# EAGLE design ATmega328P-StripBd (EAGLE 9.2.2)
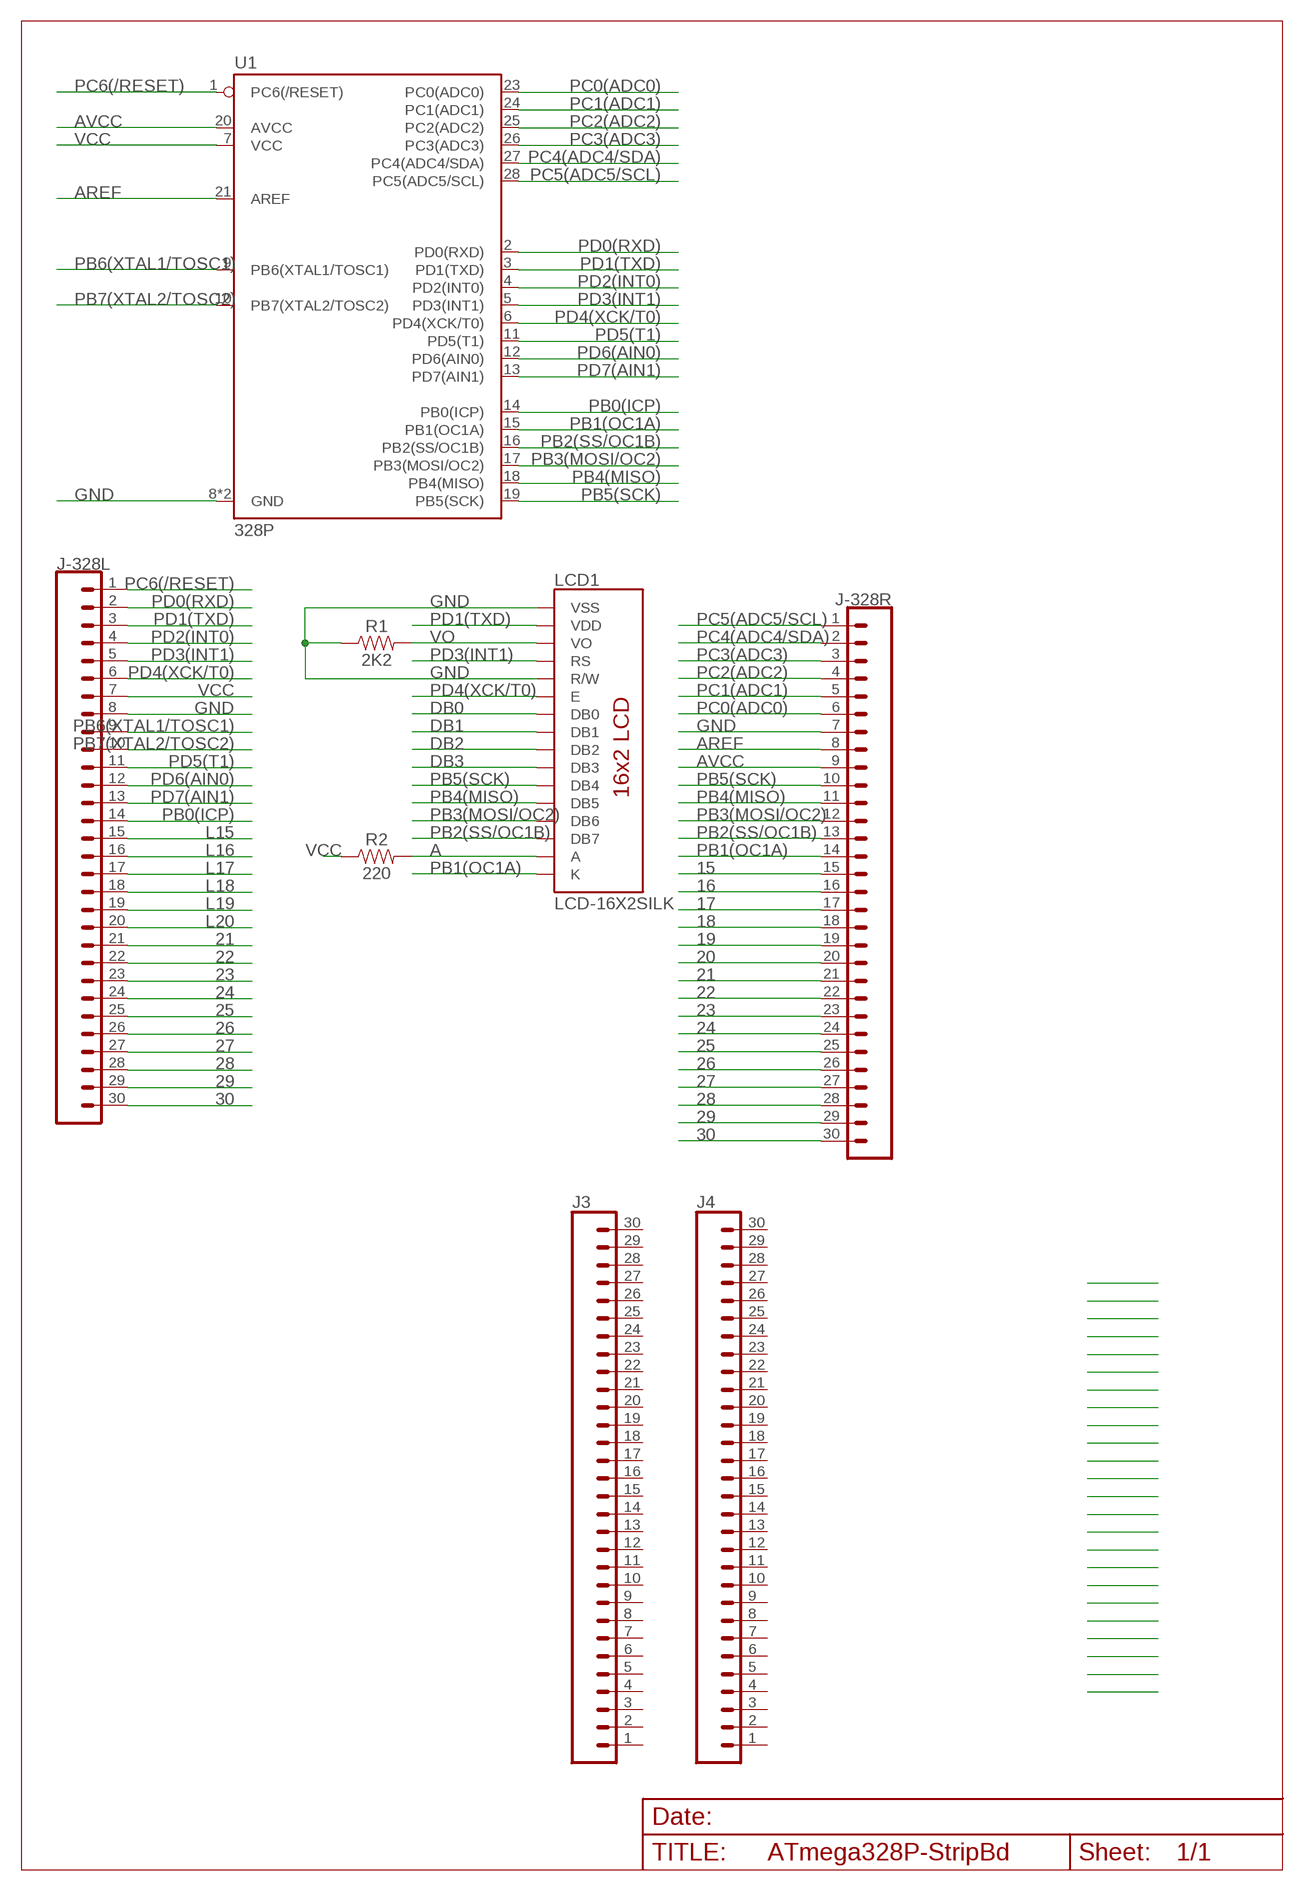
[diagram p0: schematic, sheet 1]

## Parts
J3  CONN_30  [1X30]
J4  CONN_30  [1X30]
J-328L  CONN_30  [1X30]
J-328R  CONN_30  [1X30]
LCD1  LCD-16X2SILK  [LCD-16X2]
R1  2K2  1KOHM-HORIZ-1/4W-5%  [AXIAL-0.3]
R2  220  1KOHM-HORIZ-1/4W-5%  [AXIAL-0.3]
U1  328P  ATMEGA328P_PDIP  [DIP28]

## Nets
15: J-328R.15
16: J-328R.16
17: J-328R.17
18: J-328R.18
19: J-328R.19
20: J-328R.20
21: J-328L.21 J-328R.21
22: J-328L.22 J-328R.22
23: J-328L.23 J-328R.23
24: J-328L.24 J-328R.24
25: J-328L.25 J-328R.25
26: J-328L.26 J-328R.26
27: J-328L.27 J-328R.27
28: J-328L.28 J-328R.28
29: J-328L.29 J-328R.29
30: J-328L.30 J-328R.30
A: LCD1.15(A) R2.P$2
AREF: J-328R.8 U1.21(AREF)
AVCC: J-328R.9 U1.20(AVCC)
DB0: LCD1.7(DB0)
DB1: LCD1.8(DB1)
DB2: LCD1.9(DB2)
DB3: LCD1.10(DB3)
GND: J-328L.8 J-328R.7 LCD1.1(VSS) LCD1.5(R/W) R1.P$1 U1.8(GND) U1.22(GND)
L15: J-328L.15
L16: J-328L.16
L17: J-328L.17
L18: J-328L.18
L19: J-328L.19
L20: J-328L.20
PB0(ICP): J-328L.14 U1.14(PB0(ICP))
PB1(OC1A): J-328R.14 LCD1.16(K) U1.15(PB1(OC1A))
PB2(SS/OC1B): J-328R.13 LCD1.14(DB7) U1.16(PB2(SS/OC1B))
PB3(MOSI/OC2): J-328R.12 LCD1.13(DB6) U1.17(PB3(MOSI/OC2))
PB4(MISO): J-328R.11 LCD1.12(DB5) U1.18(PB4(MISO))
PB5(SCK): J-328R.10 LCD1.11(DB4) U1.19(PB5(SCK))
PB6(XTAL1/TOSC1): J-328L.9 U1.9(PB6(XTAL1/TOSC1))
PB7(XTAL2/TOSC2): J-328L.10 U1.10(PB7(XTAL2/TOSC2))
PC0(ADC0): J-328R.6 U1.23(PC0(ADC0))
PC1(ADC1): J-328R.5 U1.24(PC1(ADC1))
PC2(ADC2): J-328R.4 U1.25(PC2(ADC2))
PC3(ADC3): J-328R.3 U1.26(PC3(ADC3))
PC4(ADC4/SDA): J-328R.2 U1.27(PC4(ADC4/SDA))
PC5(ADC5/SCL): J-328R.1 U1.28(PC5(ADC5/SCL))
PC6(/RESET): J-328L.1 U1.1(PC6(/RESET))
PD0(RXD): J-328L.2 U1.2(PD0(RXD))
PD1(TXD): J-328L.3 LCD1.2(VDD) U1.3(PD1(TXD))
PD2(INT0): J-328L.4 U1.4(PD2(INT0))
PD3(INT1): J-328L.5 LCD1.4(RS) U1.5(PD3(INT1))
PD4(XCK/T0): J-328L.6 LCD1.6(E) U1.6(PD4(XCK/T0))
PD5(T1): J-328L.11 U1.11(PD5(T1))
PD6(AIN0): J-328L.12 U1.12(PD6(AIN0))
PD7(AIN1): J-328L.13 U1.13(PD7(AIN1))
VCC: J-328L.7 R2.P$1 U1.7(VCC)
VO: LCD1.3(VO) R1.P$2
Unconnected: J3.1 J3.2 J3.3 J3.4 J3.5 J3.6 J3.7 J3.8 J3.9 J3.10 J3.11 J3.12 J3.13 J3.14 J3.15 J3.16 J3.17 J3.18 J3.19 J3.20 J3.21 J3.22 J3.23 J3.24 J3.25 J3.26 J3.27 J3.28 J3.29 J3.30 J4.1 J4.2 J4.3 J4.4 J4.5 J4.6 J4.7 J4.8 J4.9 J4.10 J4.11 J4.12 J4.13 J4.14 J4.15 J4.16 J4.17 J4.18 J4.19 J4.20 J4.21 J4.22 J4.23 J4.24 J4.25 J4.26 J4.27 J4.28 J4.29 J4.30

## Library data of the parts
J3 J4 J-328L J-328R = SparkFun-Connectors:CONN_30: Multi connection point. Often used as Generic Header-pin footprint for 0.1 inch spaced/style header connections On any of the 0.1 inch spaced packages, you can populate with these: Break Away Headers - Straight <https://www.sparkfun.com/products/116> (PRT-00116) Break Away Male Headers - Right Angle <https://www.sparkfun.com/products/553> (PRT-00553) Female Headers <https://www.sparkfun.com/products/115> (PRT-00115) Break Away Headers - Machine Pin <https://www.sparkfun.com/products/117> (PRT-00117) Break Away Female Headers - Swiss Machine Pin <https://www.sparkfun.com/products/743> (PRT-00743) For SCREWTERMINALS and SPRING TERMINALS visit here: Screw Terimnals on SparkFun.com <https://www.sparkfun.com/search/results?term=Screw+Terminals> (5mm/3.5mm/2.54mm spacing) This device is also useful as a general connection point to wire up your design to another part of your project. Our various solder wires solder well into these plated through hole pads. Hook-Up Wire - Assortment (Stranded, 22 AWG) <https://www.sparkfun.com/products/11375> (PRT-11375) Hook-Up Wire - Assortment (Solid Core, 22 AWG) <https://www.sparkfun.com/products/11367> (PRT-11367) View the entire wire category on our website here <https://www.sparkfun.com/categories/141> Special notes: Molex polarized connector foot print use with SKU : PRT-08231 with associated crimp pins and housings. 1MM SMD Version SKU: PRT-10208 NOTES ON THE VARIANTS LOCK and LOCK_LONGPADS... This footprint was designed to help hold the alignment of a through-hole component (i.e. 6-pin header) while soldering it into place. You may notice that each hole has been shifted either up or down by 0.005 of an inch from it's more standard position (which is a perfectly straight line). This slight alteration caused the pins (the squares in the middle) to touch the edges of the holes. Because they are alternating, it causes a "brace" to hold the component in place. 0.005 has proven to be the perfect amount of "off-center" position when using our standard breakaway headers. Although looks a little odd when you look at the bare footprint, once you have a header in there, the alteration is very hard to notice. Also,if you push a header all the way into place, it is covered up entirely on the bottom side.
LCD1 = SparkFun-Displays:LCD-16X2: Standard text-only 16x2 parallel input LCD Basic 16 character by 2 line display. Typically utilizes the extremely common HD44780 parallel interface chipset SparkFun Products: Basic 16x2 Green <https://www.sparkfun.com/products/255> Basic 8x2 Green <https://www.sparkfun.com/products/11122>; SF_ID: LCD-00255
R1 R2 = SparkFun-Resistors:1KOHM: 1kΩ resistor A resistor is a passive two-terminal electrical component that implements electrical resistance as a circuit element. Resistors act to reduce current flow, and, at the same time, act to lower voltage levels within circuits. - Wikipedia; PROD_ID: RES-08380; VALUE: 1k
U1 = SparkFun-IC-Microcontroller:ATMEGA328P_PDIP: Atmel 328P Through hole ATMEGA328P uC used in the Arduino 32kb flash, 1k EEPROM, 2k SRAM Datasheet <http://www.sparkfun.com/datasheets/Components/SMD/ATMega328.pdf> SparkFun Products Storefront component: AVR 28 Pin 20MHz 32K 6A/D - ATMega328P <https://www.sparkfun.com/products/9061> (COM-09061) SparkFun Simon Says - Through-Hole Soldering Kit <https://www.sparkfun.com/products/10547> (KIT-10547) SparkFun Learn to Solder - Simon Says <https://www.sparkfun.com/products/13708> (KIT-13708) SparkFun BigTime Watch Kit <https://www.sparkfun.com/products/11734> (KIT-11734) SparkFun ClockIt <https://www.sparkfun.com/products/10930> (KIT-10930) SparkFun Serial Enabled LCD Kit <https://www.sparkfun.com/products/10097> (LCD-10097) SparkFun Simon Tilts - Through Hole Soldering Kit <https://www.sparkfun.com/products/12634> (KIT-12634) SparkFun Frequency Counter Kit <https://www.sparkfun.com/products/10140> (KIT-10140) FabFM Radio Kit <https://www.sparkfun.com/products/11043> (KIT-11043) SparkFun Binary Blaster Kit <https://www.sparkfun.com/products/12037> (KIT-12037) SparkFun Metro-Gnome <https://www.sparkfun.com/products/9236> (KIT-09236) ATmega328 with Arduino Optiboot (Uno) <https://www.sparkfun.com/products/10524> (DEV-10524); PROD_ID: IC-09136

## Board
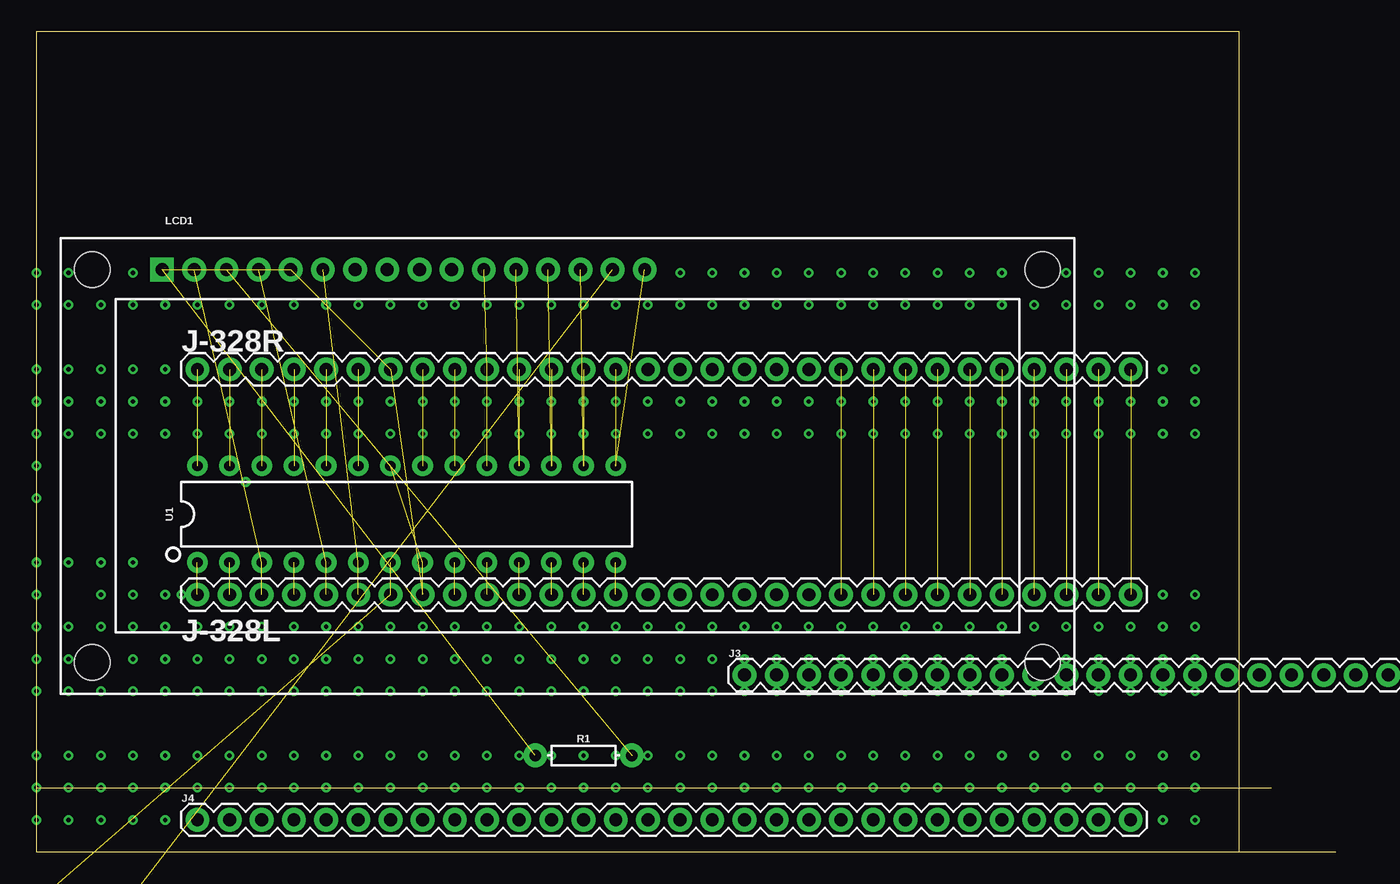
[diagram p1: board, top side]

Size 102.54 x 64.76 mm. Coordinates in mm from the lower left corner, seen from the top.
Outline: 94.92,0 94.92,64.76 0,64.76 0,0 94.92,0
Outline: 94.92,0 102.54,0
Outline: 0,5.08 97.46,5.08
Copper layers (1*16): Top 0.035mm / dielectric 1.5mm / Bottom 0.035mm
Design rules "default": minimum track width 6mil, minimum drill 0.35mm, track to track 6mil, track to pad 6mil, pad to pad 6mil, via to via 6mil, smd to smd 6mil, copper to edge 40mil, drill to drill 6mil, minimum pad ring 10mil, minimum via ring 8mil, stop-mask expansion 4mil, vias tented up to drill 0mil, thermal gap 10mil

### Footprints (pad centres in the part's own frame; a part is rotated, then mirrored left to right if it is on the bottom)
1X30 = drill 1.016 pad 1.88: 1 0,0; 2 2.54,0; 3 5.08,0; 4 7.62,0; 5 10.16,0; 6 12.7,0; 7 15.24,0; 8 17.78,0; 9 20.32,0; 10 22.86,0; 11 25.4,0; 12 27.94,0; 13 30.48,0; 14 33.02,0; 15 35.56,0; 16 38.1,0; 17 40.64,0; 18 43.18,0; 19 45.72,0; 20 48.26,0; 21 50.8,0; 22 53.34,0; 23 55.88,0; 24 58.42,0; 25 60.96,0; 26 63.5,0; 27 66.04,0; 28 68.58,0; 29 71.12,0; 30 73.66,0
LCD-16X2 = drill 1.016 pad 1.88 square: 1 -32,15.5 | drill 1.016 pad 1.88: 2 -29.46,15.5; 3 -26.92,15.5; 4 -24.38,15.5; 5 -21.84,15.5; 6 -19.3,15.5; 7 -16.76,15.5; 8 -14.22,15.5; 9 -11.68,15.5; 10 -9.14,15.5; 11 -6.6,15.5; 12 -4.06,15.5; 13 -1.52,15.5; 14 1.02,15.5; 15 3.56,15.5; 16 6.1,15.5 | hole 2.8: -37.5,15.5; -37.5,-15.5; 37.5,15.5; 37.5,-15.5
AXIAL-0.3 = drill 0.9 pad 1.88: P$1 -3.81,0; P$2 3.81,0
DIP28 = drill 0.813 pad 1.626: 1 -16.51,-3.81; 2 -13.97,-3.81; 3 -11.43,-3.81; 4 -8.89,-3.81; 5 -6.35,-3.81; 6 -3.81,-3.81; 7 -1.27,-3.81; 8 1.27,-3.81; 9 3.81,-3.81; 10 6.35,-3.81; 11 8.89,-3.81; 12 11.43,-3.81; 13 13.97,-3.81; 14 16.51,-3.81; 15 16.51,3.81; 16 13.97,3.81; 17 11.43,3.81; 18 8.89,3.81; 19 6.35,3.81; 20 3.81,3.81; 21 1.27,3.81; 22 -1.27,3.81; 23 -3.81,3.81; 24 -6.35,3.81; 25 -8.89,3.81; 26 -11.43,3.81; 27 -13.97,3.81; 28 -16.51,3.81

### Placement (x,y rotation side)
J3  55.88,13.97 0 top
J4  12.7,2.54 0 top
J-328L  12.7,20.32 0 top
J-328R  12.7,38.1 0 top
LCD1  41.91,30.48 0 top
R1  43.18,7.62 0 top
R2  2.54,-5.08 0 top  (outside the outline)
U1  29.21,26.67 0 top

### Tracks (layer width: path | path; a pad name or v marks a point on that pad's centre or on a via)
21  (1 unrouted)
22  (1 unrouted)
23  (1 unrouted)
24  (1 unrouted)
25  (1 unrouted)
26  (1 unrouted)
27  (1 unrouted)
28  (1 unrouted)
29  (1 unrouted)
30  (1 unrouted)
A  (1 unrouted)
AREF  (1 unrouted)
AVCC  (1 unrouted)
GND  (6 unrouted)
N$9  (via drill 0.35)
  other vias: 0,5.08
N$10  (via drill 0.35)
  other vias: 0,2.54
N$11  (via drill 0.35)
  other vias: 0,30.48
N$12  (via drill 0.35)
  other vias: 0,33.02
N$13  (via drill 0.35)
  other vias: 0,12.7 0,27.94
N$14  (via drill 0.35)
  other vias: 0,15.24
N$15  (via drill 0.35)
  other vias: 0,17.78
N$16  (via drill 0.35)
  other vias: 0,20.32
N$17  (via drill 0.35)
  other vias: 0,22.86
N$18  (via drill 0.35)
  other vias: 0,35.56
N$19  (via drill 0.35)
  other vias: 0,38.1
N$20  (via drill 0.35)
  other vias: 0,43.18
N$21  (via drill 0.35)
  other vias: 0,45.72
N$22  (via drill 0.35)
  other vias: 0,7.62
N$23  (via drill 0.35)
  other vias: 2.54,15.24
N$24  (via drill 0.35)
  other vias: 2.54,17.78
N$25  (via drill 0.35)
  other vias: 11.43,20.32
N$26  (via drill 0.35)
  other vias: 2.54,22.86
N$27  (via drill 0.35)
  other vias: 5.08,15.24
N$28  (via drill 0.35)
  other vias: 5.08,17.78
N$29  (via drill 0.35)
  other vias: 5.08,20.32
N$30  (via drill 0.35)
  other vias: 5.08,22.86
N$31  (via drill 0.35)
  other vias: 7.62,15.24
N$32  (via drill 0.35)
  other vias: 7.62,17.78
N$33  (via drill 0.35)
  other vias: 7.62,20.32
N$34  (via drill 0.35)
  other vias: 7.62,22.86
N$35  (via drill 0.35)
  other vias: 2.54,12.7
N$36  (via drill 0.35)
  other vias: 5.08,12.7
N$37  (via drill 0.35)
  other vias: 7.62,12.7
N$38  (via drill 0.35)
  other vias: 10.16,15.24
N$39  (via drill 0.35)
  other vias: 10.16,17.78
N$40  (via drill 0.35)
  other vias: 10.16,20.32
N$41  (via drill 0.35)
  other vias: 12.7,15.24
N$42  (via drill 0.35)
  other vias: 12.7,17.78
N$43  (via drill 0.35)
  other vias: 12.7,20.32
N$44  (via drill 0.35)
  other vias: 15.24,15.24
N$45  (via drill 0.35)
  other vias: 15.24,17.78
N$46  (via drill 0.35)
  other vias: 15.24,20.32
N$47  (via drill 0.35)
  other vias: 10.16,12.7
N$48  (via drill 0.35)
  other vias: 12.7,12.7
N$49  (via drill 0.35)
  other vias: 15.24,12.7
N$50  (via drill 0.35)
  other vias: 17.78,15.24
N$51  (via drill 0.35)
  other vias: 17.78,17.78
N$52  (via drill 0.35)
  other vias: 17.78,20.32
N$53  (via drill 0.35)
  other vias: 20.32,15.24
N$54  (via drill 0.35)
  other vias: 20.32,17.78
N$55  (via drill 0.35)
  other vias: 20.32,20.32
N$56  (via drill 0.35)
  other vias: 22.86,15.24
N$57  (via drill 0.35)
  other vias: 22.86,17.78
N$58  (via drill 0.35)
  other vias: 22.86,20.32
N$59  (via drill 0.35)
  other vias: 17.78,12.7
N$60  (via drill 0.35)
  other vias: 20.32,12.7
N$61  (via drill 0.35)
  other vias: 22.86,12.7
N$62  (via drill 0.35)
  other vias: 25.4,15.24
N$63  (via drill 0.35)
  other vias: 25.4,17.78
N$64  (via drill 0.35)
  other vias: 25.4,20.32
N$65  (via drill 0.35)
  other vias: 27.94,15.24
N$66  (via drill 0.35)
  other vias: 27.94,17.78
N$67  (via drill 0.35)
  other vias: 27.94,20.32
N$68  (via drill 0.35)
  other vias: 30.48,15.24
N$69  (via drill 0.35)
  other vias: 30.48,17.78
N$70  (via drill 0.35)
  other vias: 30.48,20.32
N$71  (via drill 0.35)
  other vias: 25.4,12.7
N$72  (via drill 0.35)
  other vias: 27.94,12.7
N$73  (via drill 0.35)
  other vias: 30.48,12.7
N$74  (via drill 0.35)
  other vias: 33.02,15.24
N$75  (via drill 0.35)
  other vias: 33.02,17.78
N$76  (via drill 0.35)
  other vias: 33.02,20.32
N$77  (via drill 0.35)
  other vias: 35.56,15.24
N$78  (via drill 0.35)
  other vias: 35.56,17.78
N$79  (via drill 0.35)
  other vias: 35.56,20.32
N$80  (via drill 0.35)
  other vias: 38.1,15.24
N$81  (via drill 0.35)
  other vias: 38.1,17.78
N$82  (via drill 0.35)
  other vias: 38.1,20.32
N$83  (via drill 0.35)
  other vias: 33.02,12.7
N$84  (via drill 0.35)
  other vias: 35.56,12.7
N$85  (via drill 0.35)
  other vias: 38.1,12.7
N$86  (via drill 0.35)
  other vias: 40.64,15.24
N$87  (via drill 0.35)
  other vias: 40.64,17.78
N$88  (via drill 0.35)
  other vias: 40.64,20.32
N$89  (via drill 0.35)
  other vias: 43.18,15.24
N$90  (via drill 0.35)
  other vias: 43.18,17.78
N$91  (via drill 0.35)
  other vias: 43.18,20.32
N$92  (via drill 0.35)
  other vias: 45.72,15.24
N$93  (via drill 0.35)
  other vias: 45.72,17.78
N$94  (via drill 0.35)
  other vias: 45.72,20.32
N$95  (via drill 0.35)
  other vias: 40.64,12.7
N$96  (via drill 0.35)
  other vias: 43.18,12.7
N$97  (via drill 0.35)
  other vias: 45.72,12.7
N$98  (via drill 0.35)
  other vias: 48.26,15.24
N$99  (via drill 0.35)
  other vias: 48.26,17.78
N$100  (via drill 0.35)
  other vias: 48.26,20.32
N$101  (via drill 0.35)
  other vias: 50.8,15.24
N$102  (via drill 0.35)
  other vias: 50.8,17.78
N$103  (via drill 0.35)
  other vias: 50.8,20.32
N$104  (via drill 0.35)
  other vias: 53.34,15.24
N$105  (via drill 0.35)
  other vias: 53.34,17.78
N$106  (via drill 0.35)
  other vias: 53.34,20.32
N$107  (via drill 0.35)
  other vias: 48.26,12.7
N$108  (via drill 0.35)
  other vias: 50.8,12.7
N$109  (via drill 0.35)
  other vias: 53.34,12.7
N$110  (via drill 0.35)
  other vias: 55.88,15.24
N$111  (via drill 0.35)
  other vias: 55.88,17.78
N$112  (via drill 0.35)
  other vias: 55.88,20.32
N$113  (via drill 0.35)
  other vias: 58.42,15.24
N$114  (via drill 0.35)
  other vias: 58.42,17.78
N$115  (via drill 0.35)
  other vias: 58.42,20.32
N$116  (via drill 0.35)
  other vias: 60.96,15.24
N$117  (via drill 0.35)
  other vias: 60.96,17.78
N$118  (via drill 0.35)
  other vias: 60.96,20.32
N$119  (via drill 0.35)
  other vias: 55.88,12.7
N$120  (via drill 0.35)
  other vias: 58.42,12.7
N$121  (via drill 0.35)
  other vias: 60.96,12.7
N$122  (via drill 0.35)
  other vias: 63.5,15.24
N$123  (via drill 0.35)
  other vias: 63.5,17.78
N$124  (via drill 0.35)
  other vias: 63.5,20.32
N$125  (via drill 0.35)
  other vias: 66.04,15.24
N$126  (via drill 0.35)
  other vias: 66.04,17.78
N$127  (via drill 0.35)
  other vias: 66.04,20.32
N$128  (via drill 0.35)
  other vias: 68.58,15.24
N$129  (via drill 0.35)
  other vias: 68.58,17.78
N$130  (via drill 0.35)
  other vias: 68.58,20.32
N$131  (via drill 0.35)
  other vias: 63.5,12.7
N$132  (via drill 0.35)
  other vias: 66.04,12.7
N$133  (via drill 0.35)
  other vias: 68.58,12.7
N$134  (via drill 0.35)
  other vias: 71.12,15.24
N$135  (via drill 0.35)
  other vias: 71.12,17.78
N$136  (via drill 0.35)
  other vias: 71.12,20.32
N$137  (via drill 0.35)
  other vias: 73.66,15.24
N$138  (via drill 0.35)
  other vias: 73.66,17.78
N$139  (via drill 0.35)
  other vias: 73.66,20.32
N$140  (via drill 0.35)
  other vias: 76.2,15.24
N$141  (via drill 0.35)
  other vias: 76.2,17.78
N$142  (via drill 0.35)
  other vias: 76.2,20.32
N$143  (via drill 0.35)
  other vias: 71.12,12.7
N$144  (via drill 0.35)
  other vias: 73.66,12.7
N$145  (via drill 0.35)
  other vias: 76.2,12.7
N$146  (via drill 0.35)
  other vias: 78.74,15.24
N$147  (via drill 0.35)
  other vias: 78.74,17.78
N$148  (via drill 0.35)
  other vias: 78.74,20.32
N$149  (via drill 0.35)
  other vias: 81.28,15.24
N$150  (via drill 0.35)
  other vias: 81.28,17.78
N$151  (via drill 0.35)
  other vias: 81.28,20.32
N$152  (via drill 0.35)
  other vias: 83.82,15.24
N$153  (via drill 0.35)
  other vias: 83.82,17.78
N$154  (via drill 0.35)
  other vias: 83.82,20.32
N$155  (via drill 0.35)
  other vias: 78.74,12.7
N$156  (via drill 0.35)
  other vias: 81.28,12.7
N$157  (via drill 0.35)
  other vias: 83.82,12.7
N$158  (via drill 0.35)
  other vias: 86.36,15.24
N$159  (via drill 0.35)
  other vias: 86.36,17.78
N$160  (via drill 0.35)
  other vias: 86.36,20.32
N$161  (via drill 0.35)
  other vias: 88.9,15.24
N$162  (via drill 0.35)
  other vias: 88.9,17.78
N$163  (via drill 0.35)
  other vias: 88.9,20.32
N$164  (via drill 0.35)
  other vias: 91.44,15.24
N$165  (via drill 0.35)
  other vias: 91.44,17.78
N$166  (via drill 0.35)
  other vias: 91.44,20.32
N$167  (via drill 0.35)
  other vias: 86.36,12.7
N$168  (via drill 0.35)
  other vias: 88.9,12.7
N$169  (via drill 0.35)
  other vias: 91.44,12.7
N$170  (via drill 0.35)
  other vias: 2.54,33.02
N$171  (via drill 0.35)
  other vias: 2.54,35.56
N$172  (via drill 0.35)
  other vias: 2.54,38.1
N$173  (via drill 0.35)
  other vias: 5.08,33.02
N$174  (via drill 0.35)
  other vias: 5.08,35.56
N$175  (via drill 0.35)
  other vias: 5.08,38.1
N$176  (via drill 0.35)
  other vias: 7.62,33.02
N$177  (via drill 0.35)
  other vias: 7.62,35.56
N$178  (via drill 0.35)
  other vias: 7.62,38.1
N$179  (via drill 0.35)
  other vias: 10.16,33.02
N$180  (via drill 0.35)
  other vias: 10.16,35.56
N$181  (via drill 0.35)
  other vias: 10.16,38.1
N$182  (via drill 0.35)
  other vias: 12.7,33.02
N$183  (via drill 0.35)
  other vias: 12.7,35.56
N$184  (via drill 0.35)
  other vias: 12.7,38.1
N$185  (via drill 0.35)
  other vias: 15.24,33.02
N$186  (via drill 0.35)
  other vias: 15.24,35.56
N$187  (via drill 0.35)
  other vias: 15.24,38.1
N$188  (via drill 0.35)
  other vias: 17.78,33.02
N$189  (via drill 0.35)
  other vias: 17.78,35.56
N$190  (via drill 0.35)
  other vias: 17.78,38.1
N$191  (via drill 0.35)
  other vias: 20.32,33.02
N$192  (via drill 0.35)
  other vias: 20.32,35.56
N$193  (via drill 0.35)
  other vias: 20.32,38.1
N$194  (via drill 0.35)
  other vias: 22.86,33.02
N$195  (via drill 0.35)
  other vias: 22.86,35.56
N$196  (via drill 0.35)
  other vias: 22.86,38.1
N$197  (via drill 0.35)
  other vias: 25.4,33.02
N$198  (via drill 0.35)
  other vias: 25.4,35.56
N$199  (via drill 0.35)
  other vias: 25.4,38.1
N$200  (via drill 0.35)
  other vias: 27.94,33.02
N$201  (via drill 0.35)
  other vias: 27.94,35.56
N$202  (via drill 0.35)
  other vias: 27.94,38.1
N$203  (via drill 0.35)
  other vias: 30.48,33.02
N$204  (via drill 0.35)
  other vias: 30.48,35.56
N$205  (via drill 0.35)
  other vias: 30.48,38.1
N$206  (via drill 0.35)
  other vias: 33.02,33.02
N$207  (via drill 0.35)
  other vias: 33.02,35.56
N$208  (via drill 0.35)
  other vias: 33.02,38.1
N$209  (via drill 0.35)
  other vias: 35.56,33.02
N$210  (via drill 0.35)
  other vias: 35.56,35.56
N$211  (via drill 0.35)
  other vias: 35.56,38.1
N$212  (via drill 0.35)
  other vias: 38.1,33.02
N$213  (via drill 0.35)
  other vias: 38.1,35.56
N$214  (via drill 0.35)
  other vias: 38.1,38.1
N$215  (via drill 0.35)
  other vias: 40.64,33.02
N$216  (via drill 0.35)
  other vias: 40.64,35.56
N$217  (via drill 0.35)
  other vias: 40.64,38.1
N$218  (via drill 0.35)
  other vias: 43.18,33.02
N$219  (via drill 0.35)
  other vias: 43.18,35.56
N$220  (via drill 0.35)
  other vias: 43.18,38.1
N$221  (via drill 0.35)
  other vias: 45.72,33.02
N$222  (via drill 0.35)
  other vias: 45.72,35.56
N$223  (via drill 0.35)
  other vias: 45.72,38.1
N$224  (via drill 0.35)
  other vias: 48.26,33.02
N$225  (via drill 0.35)
  other vias: 48.26,35.56
N$226  (via drill 0.35)
  other vias: 48.26,38.1
N$227  (via drill 0.35)
  other vias: 50.8,33.02
N$228  (via drill 0.35)
  other vias: 50.8,35.56
N$229  (via drill 0.35)
  other vias: 16.51,29.21
N$230  (via drill 0.35)
  other vias: 53.34,33.02
N$231  (via drill 0.35)
  other vias: 53.34,35.56
N$232  (via drill 0.35)
  other vias: 53.34,38.1
N$233  (via drill 0.35)
  other vias: 55.88,33.02
N$234  (via drill 0.35)
  other vias: 55.88,35.56
N$235  (via drill 0.35)
  other vias: 55.88,38.1
N$236  (via drill 0.35)
  other vias: 58.42,33.02
N$237  (via drill 0.35)
  other vias: 58.42,35.56
N$238  (via drill 0.35)
  other vias: 58.42,38.1
N$239  (via drill 0.35)
  other vias: 60.96,33.02
N$240  (via drill 0.35)
  other vias: 60.96,35.56
N$241  (via drill 0.35)
  other vias: 60.96,38.1
N$242  (via drill 0.35)
  other vias: 63.5,33.02
N$243  (via drill 0.35)
  other vias: 63.5,35.56
N$244  (via drill 0.35)
  other vias: 63.5,38.1
N$245  (via drill 0.35)
  other vias: 66.04,33.02
N$246  (via drill 0.35)
  other vias: 66.04,35.56
N$247  (via drill 0.35)
  other vias: 66.04,38.1
N$248  (via drill 0.35)
  other vias: 68.58,33.02
N$249  (via drill 0.35)
  other vias: 68.58,35.56
N$250  (via drill 0.35)
  other vias: 68.58,38.1
N$251  (via drill 0.35)
  other vias: 71.12,33.02
N$252  (via drill 0.35)
  other vias: 71.12,35.56
N$253  (via drill 0.35)
  other vias: 71.12,38.1
N$254  (via drill 0.35)
  other vias: 73.66,33.02
N$255  (via drill 0.35)
  other vias: 73.66,35.56
N$256  (via drill 0.35)
  other vias: 73.66,38.1
N$257  (via drill 0.35)
  other vias: 76.2,33.02
N$258  (via drill 0.35)
  other vias: 76.2,35.56
N$259  (via drill 0.35)
  other vias: 76.2,38.1
N$260  (via drill 0.35)
  other vias: 78.74,33.02
N$261  (via drill 0.35)
  other vias: 78.74,35.56
N$262  (via drill 0.35)
  other vias: 78.74,38.1
N$263  (via drill 0.35)
  other vias: 81.28,33.02
N$264  (via drill 0.35)
  other vias: 81.28,35.56
N$265  (via drill 0.35)
  other vias: 81.28,38.1
N$266  (via drill 0.35)
  other vias: 83.82,33.02
N$267  (via drill 0.35)
  other vias: 83.82,35.56
N$268  (via drill 0.35)
  other vias: 83.82,38.1
N$269  (via drill 0.35)
  other vias: 86.36,33.02
N$270  (via drill 0.35)
  other vias: 86.36,35.56
N$271  (via drill 0.35)
  other vias: 86.36,38.1
N$272  (via drill 0.35)
  other vias: 88.9,33.02
N$273  (via drill 0.35)
  other vias: 88.9,35.56
N$274  (via drill 0.35)
  other vias: 88.9,38.1
N$275  (via drill 0.35)
  other vias: 91.44,33.02
N$276  (via drill 0.35)
  other vias: 91.44,35.56
N$277  (via drill 0.35)
  other vias: 91.44,38.1
N$278  (via drill 0.35)
  other vias: 2.54,2.54
N$279  (via drill 0.35)
  other vias: 2.54,5.08
N$280  (via drill 0.35)
  other vias: 2.54,7.62
N$281  (via drill 0.35)
  other vias: 5.08,2.54
N$282  (via drill 0.35)
  other vias: 5.08,5.08
N$283  (via drill 0.35)
  other vias: 5.08,7.62
N$284  (via drill 0.35)
  other vias: 7.62,2.54
N$285  (via drill 0.35)
  other vias: 7.62,5.08
N$286  (via drill 0.35)
  other vias: 7.62,7.62
N$287  (via drill 0.35)
  other vias: 10.16,2.54
N$288  (via drill 0.35)
  other vias: 10.16,5.08
N$289  (via drill 0.35)
  other vias: 10.16,7.62
N$290  (via drill 0.35)
  other vias: 12.7,2.54
N$291  (via drill 0.35)
  other vias: 12.7,5.08
N$292  (via drill 0.35)
  other vias: 12.7,7.62
N$293  (via drill 0.35)
  other vias: 15.24,2.54
N$294  (via drill 0.35)
  other vias: 15.24,5.08
N$295  (via drill 0.35)
  other vias: 15.24,7.62
N$296  (via drill 0.35)
  other vias: 17.78,2.54
N$297  (via drill 0.35)
  other vias: 17.78,5.08
N$298  (via drill 0.35)
  other vias: 17.78,7.62
N$299  (via drill 0.35)
  other vias: 20.32,2.54
N$300  (via drill 0.35)
  other vias: 20.32,5.08
N$301  (via drill 0.35)
  other vias: 20.32,7.62
N$302  (via drill 0.35)
  other vias: 22.86,2.54
N$303  (via drill 0.35)
  other vias: 22.86,5.08
N$304  (via drill 0.35)
  other vias: 22.86,7.62
N$305  (via drill 0.35)
  other vias: 25.4,2.54
N$306  (via drill 0.35)
  other vias: 25.4,5.08
N$307  (via drill 0.35)
  other vias: 25.4,7.62
N$308  (via drill 0.35)
  other vias: 27.94,2.54
N$309  (via drill 0.35)
  other vias: 27.94,5.08
N$310  (via drill 0.35)
  other vias: 27.94,7.62
N$311  (via drill 0.35)
  other vias: 30.48,2.54
N$312  (via drill 0.35)
  other vias: 30.48,5.08
N$313  (via drill 0.35)
  other vias: 30.48,7.62
N$314  (via drill 0.35)
  other vias: 33.02,2.54
N$315  (via drill 0.35)
  other vias: 33.02,5.08
N$316  (via drill 0.35)
  other vias: 33.02,7.62
N$317  (via drill 0.35)
  other vias: 35.56,2.54
N$318  (via drill 0.35)
  other vias: 35.56,5.08
N$319  (via drill 0.35)
  other vias: 35.56,7.62
N$320  (via drill 0.35)
  other vias: 38.1,2.54
N$321  (via drill 0.35)
  other vias: 38.1,5.08
N$322  (via drill 0.35)
  other vias: 38.1,7.62
N$323  (via drill 0.35)
  other vias: 40.64,2.54
N$324  (via drill 0.35)
  other vias: 40.64,5.08
N$325  (via drill 0.35)
  other vias: 40.64,7.62
N$326  (via drill 0.35)
  other vias: 43.18,2.54
N$327  (via drill 0.35)
  other vias: 43.18,5.08
N$328  (via drill 0.35)
  other vias: 43.18,7.62
N$329  (via drill 0.35)
  other vias: 45.72,2.54
N$330  (via drill 0.35)
  other vias: 45.72,5.08
N$331  (via drill 0.35)
  other vias: 45.72,7.62
N$332  (via drill 0.35)
  other vias: 48.26,2.54
N$333  (via drill 0.35)
  other vias: 48.26,5.08
N$334  (via drill 0.35)
  other vias: 48.26,7.62
N$335  (via drill 0.35)
  other vias: 50.8,2.54
N$336  (via drill 0.35)
  other vias: 50.8,5.08
N$337  (via drill 0.35)
  other vias: 50.8,7.62
N$338  (via drill 0.35)
  other vias: 53.34,2.54
N$339  (via drill 0.35)
  other vias: 53.34,5.08
N$340  (via drill 0.35)
  other vias: 53.34,7.62
N$341  (via drill 0.35)
  other vias: 55.88,2.54
N$342  (via drill 0.35)
  other vias: 55.88,5.08
N$343  (via drill 0.35)
  other vias: 55.88,7.62
N$344  (via drill 0.35)
  other vias: 58.42,2.54
N$345  (via drill 0.35)
  other vias: 58.42,5.08
N$346  (via drill 0.35)
  other vias: 58.42,7.62
N$347  (via drill 0.35)
  other vias: 60.96,2.54
N$348  (via drill 0.35)
  other vias: 60.96,5.08
N$349  (via drill 0.35)
  other vias: 60.96,7.62
N$350  (via drill 0.35)
  other vias: 63.5,2.54
N$351  (via drill 0.35)
  other vias: 63.5,5.08
N$352  (via drill 0.35)
  other vias: 63.5,7.62
N$353  (via drill 0.35)
  other vias: 66.04,2.54
N$354  (via drill 0.35)
  other vias: 66.04,5.08
N$355  (via drill 0.35)
  other vias: 66.04,7.62
N$356  (via drill 0.35)
  other vias: 68.58,2.54
N$357  (via drill 0.35)
  other vias: 68.58,5.08
N$358  (via drill 0.35)
  other vias: 68.58,7.62
N$359  (via drill 0.35)
  other vias: 71.12,2.54
N$360  (via drill 0.35)
  other vias: 71.12,5.08
N$361  (via drill 0.35)
  other vias: 71.12,7.62
N$362  (via drill 0.35)
  other vias: 73.66,2.54
N$363  (via drill 0.35)
  other vias: 73.66,5.08
N$364  (via drill 0.35)
  other vias: 73.66,7.62
N$365  (via drill 0.35)
  other vias: 76.2,2.54
N$366  (via drill 0.35)
  other vias: 76.2,5.08
N$367  (via drill 0.35)
  other vias: 76.2,7.62
N$368  (via drill 0.35)
  other vias: 78.74,2.54
N$369  (via drill 0.35)
  other vias: 78.74,5.08
N$370  (via drill 0.35)
  other vias: 78.74,7.62
N$371  (via drill 0.35)
  other vias: 81.28,2.54
N$372  (via drill 0.35)
  other vias: 81.28,5.08
N$373  (via drill 0.35)
  other vias: 81.28,7.62
N$374  (via drill 0.35)
  other vias: 83.82,2.54
N$375  (via drill 0.35)
  other vias: 83.82,5.08
N$376  (via drill 0.35)
  other vias: 83.82,7.62
N$377  (via drill 0.35)
  other vias: 86.36,2.54
N$378  (via drill 0.35)
  other vias: 86.36,5.08
N$379  (via drill 0.35)
  other vias: 86.36,7.62
N$380  (via drill 0.35)
  other vias: 88.9,2.54
N$381  (via drill 0.35)
  other vias: 88.9,5.08
N$382  (via drill 0.35)
  other vias: 88.9,7.62
N$383  (via drill 0.35)
  other vias: 91.44,2.54
N$384  (via drill 0.35)
  other vias: 91.44,5.08
N$385  (via drill 0.35)
  other vias: 91.44,7.62
N$386  (via drill 0.35)
  other vias: 2.54,43.18
N$387  (via drill 0.35)
  other vias: 2.54,45.72
N$388  (via drill 0.35)
  other vias: 5.08,43.18
N$389  (via drill 0.35)
  other vias: 5.08,45.72
N$390  (via drill 0.35)
  other vias: 7.62,43.18
N$391  (via drill 0.35)
  other vias: 7.62,45.72
N$392  (via drill 0.35)
  other vias: 10.16,43.18
N$393  (via drill 0.35)
  other vias: 10.16,45.72
N$394  (via drill 0.35)
  other vias: 12.7,43.18
N$395  (via drill 0.35)
  other vias: 12.7,45.72
N$396  (via drill 0.35)
  other vias: 15.24,43.18
N$397  (via drill 0.35)
  other vias: 15.24,45.72
N$398  (via drill 0.35)
  other vias: 17.78,43.18
N$399  (via drill 0.35)
  other vias: 17.78,45.72
N$400  (via drill 0.35)
  other vias: 20.32,43.18
N$401  (via drill 0.35)
  other vias: 20.32,45.72
N$402  (via drill 0.35)
  other vias: 22.86,43.18
N$403  (via drill 0.35)
  other vias: 22.86,45.72
N$404  (via drill 0.35)
  other vias: 25.4,43.18
N$405  (via drill 0.35)
  other vias: 25.4,45.72
N$406  (via drill 0.35)
  other vias: 27.94,43.18
N$407  (via drill 0.35)
  other vias: 27.94,45.72
N$408  (via drill 0.35)
  other vias: 30.48,43.18
N$409  (via drill 0.35)
  other vias: 30.48,45.72
N$410  (via drill 0.35)
  other vias: 33.02,43.18
N$411  (via drill 0.35)
  other vias: 33.02,45.72
N$412  (via drill 0.35)
  other vias: 35.56,43.18
N$413  (via drill 0.35)
  other vias: 35.56,45.72
N$414  (via drill 0.35)
  other vias: 38.1,43.18
N$415  (via drill 0.35)
  other vias: 38.1,45.72
N$416  (via drill 0.35)
  other vias: 40.64,43.18
N$417  (via drill 0.35)
  other vias: 40.64,45.72
N$418  (via drill 0.35)
  other vias: 43.18,43.18
N$419  (via drill 0.35)
  other vias: 43.18,45.72
N$420  (via drill 0.35)
  other vias: 45.72,43.18
N$421  (via drill 0.35)
  other vias: 45.72,45.72
N$422  (via drill 0.35)
  other vias: 48.26,43.18
N$423  (via drill 0.35)
  other vias: 48.26,45.72
N$424  (via drill 0.35)
  other vias: 50.8,43.18
N$425  (via drill 0.35)
  other vias: 50.8,45.72
N$426  (via drill 0.35)
  other vias: 53.34,43.18
N$427  (via drill 0.35)
  other vias: 53.34,45.72
N$428  (via drill 0.35)
  other vias: 55.88,43.18
N$429  (via drill 0.35)
  other vias: 55.88,45.72
N$430  (via drill 0.35)
  other vias: 58.42,43.18
N$431  (via drill 0.35)
  other vias: 58.42,45.72
N$432  (via drill 0.35)
  other vias: 60.96,43.18
N$433  (via drill 0.35)
  other vias: 60.96,45.72
N$434  (via drill 0.35)
  other vias: 63.5,43.18
N$435  (via drill 0.35)
  other vias: 63.5,45.72
N$436  (via drill 0.35)
  other vias: 66.04,43.18
N$437  (via drill 0.35)
  other vias: 66.04,45.72
N$438  (via drill 0.35)
  other vias: 68.58,43.18
N$439  (via drill 0.35)
  other vias: 68.58,45.72
N$440  (via drill 0.35)
  other vias: 71.12,43.18
N$441  (via drill 0.35)
  other vias: 71.12,45.72
N$442  (via drill 0.35)
  other vias: 73.66,43.18
N$443  (via drill 0.35)
  other vias: 73.66,45.72
N$444  (via drill 0.35)
  other vias: 76.2,43.18
N$445  (via drill 0.35)
  other vias: 76.2,45.72
N$446  (via drill 0.35)
  other vias: 78.74,43.18
N$447  (via drill 0.35)
  other vias: 78.74,45.72
N$448  (via drill 0.35)
  other vias: 81.28,43.18
N$449  (via drill 0.35)
  other vias: 81.28,45.72
N$450  (via drill 0.35)
  other vias: 83.82,43.18
N$451  (via drill 0.35)
  other vias: 83.82,45.72
N$452  (via drill 0.35)
  other vias: 86.36,43.18
N$453  (via drill 0.35)
  other vias: 86.36,45.72
N$454  (via drill 0.35)
  other vias: 88.9,43.18
N$455  (via drill 0.35)
  other vias: 88.9,45.72
N$456  (via drill 0.35)
  other vias: 91.44,43.18
N$457  (via drill 0.35)
  other vias: 91.44,45.72
PB0(ICP)  (1 unrouted)
PB1(OC1A)  (2 unrouted)
PB2(SS/OC1B)  (2 unrouted)
PB3(MOSI/OC2)  (2 unrouted)
PB4(MISO)  (2 unrouted)
PB5(SCK)  (2 unrouted)
PB6(XTAL1/TOSC1)  (1 unrouted)
PB7(XTAL2/TOSC2)  (1 unrouted)
PC0(ADC0)  (1 unrouted)
PC1(ADC1)  (1 unrouted)
PC2(ADC2)  (1 unrouted)
PC3(ADC3)  (1 unrouted)
PC4(ADC4/SDA)  (1 unrouted)
PC5(ADC5/SCL)  (1 unrouted)
PC6(/RESET)  (1 unrouted)
PD0(RXD)  (1 unrouted)
PD1(TXD)  (2 unrouted)
PD2(INT0)  (1 unrouted)
PD3(INT1)  (2 unrouted)
PD4(XCK/T0)  (2 unrouted)
PD5(T1)  (1 unrouted)
PD6(AIN0)  (1 unrouted)
PD7(AIN1)  (1 unrouted)
VCC  (2 unrouted)
VO  (1 unrouted)

### Text on the board
tValues: 1 2 | 1 2 3 4 5 | 1 2 3 4 5 | 1 2 3 4 5 | 1 2 3 | 1 2 3 4 5 | 6 7 8 9 10 | 1 2 3 4 5 | 6 7 8 9 20 | 1 2 3 4 5 | 6 7 8 9 30 | 1 2 3 4 35 | 36